# Altium schematic sheet T1_Power_Top_Level.SchDoc
size 431 x 279 mm; Date: Not shown in title block; ApprovedBy: Not shown in title block; CheckedBy: Not shown in title block; Author: Not shown in title block; CompanyName: Not shown in title block; DrawnBy: Andy Lin (TI); Engineer: Not shown in title block; Organization: Not shown in title block; Address1: Not shown in title block; Address2: Not shown in title block; Address3: Not shown in title block; Address4: Not shown in title block; DocumentNumber: 3; Revision: Use project parameter SCH_Rev; SheetNumber: 3; SheetTotal: 14; PageSetup: Record=PageOptions|CenterHorizontal=True|CenterVertical=True|PrintScale=1.00|XCorrection=1.00|YCorrection=1.00|PrintKind=0|BorderSize=5000000|LeftOffset=0|BottomOffset=0|Orientation=2|PaperLength=1000|PaperWidth=1000|Scale=100|PaperSource=15|PrintQuality=600|MediaType=1|DitherType=10|PaperKind=Letter|PrintScaleMode=1; CurrentTime: Not shown in title block; CurrentDate: Not shown in title block; Time: Not shown in title block; DocumentFullPathAndName: Not shown in title block; DocumentName: Not shown in title block; ModifiedDate: Not shown in title block; ImagePath: Not shown in title block
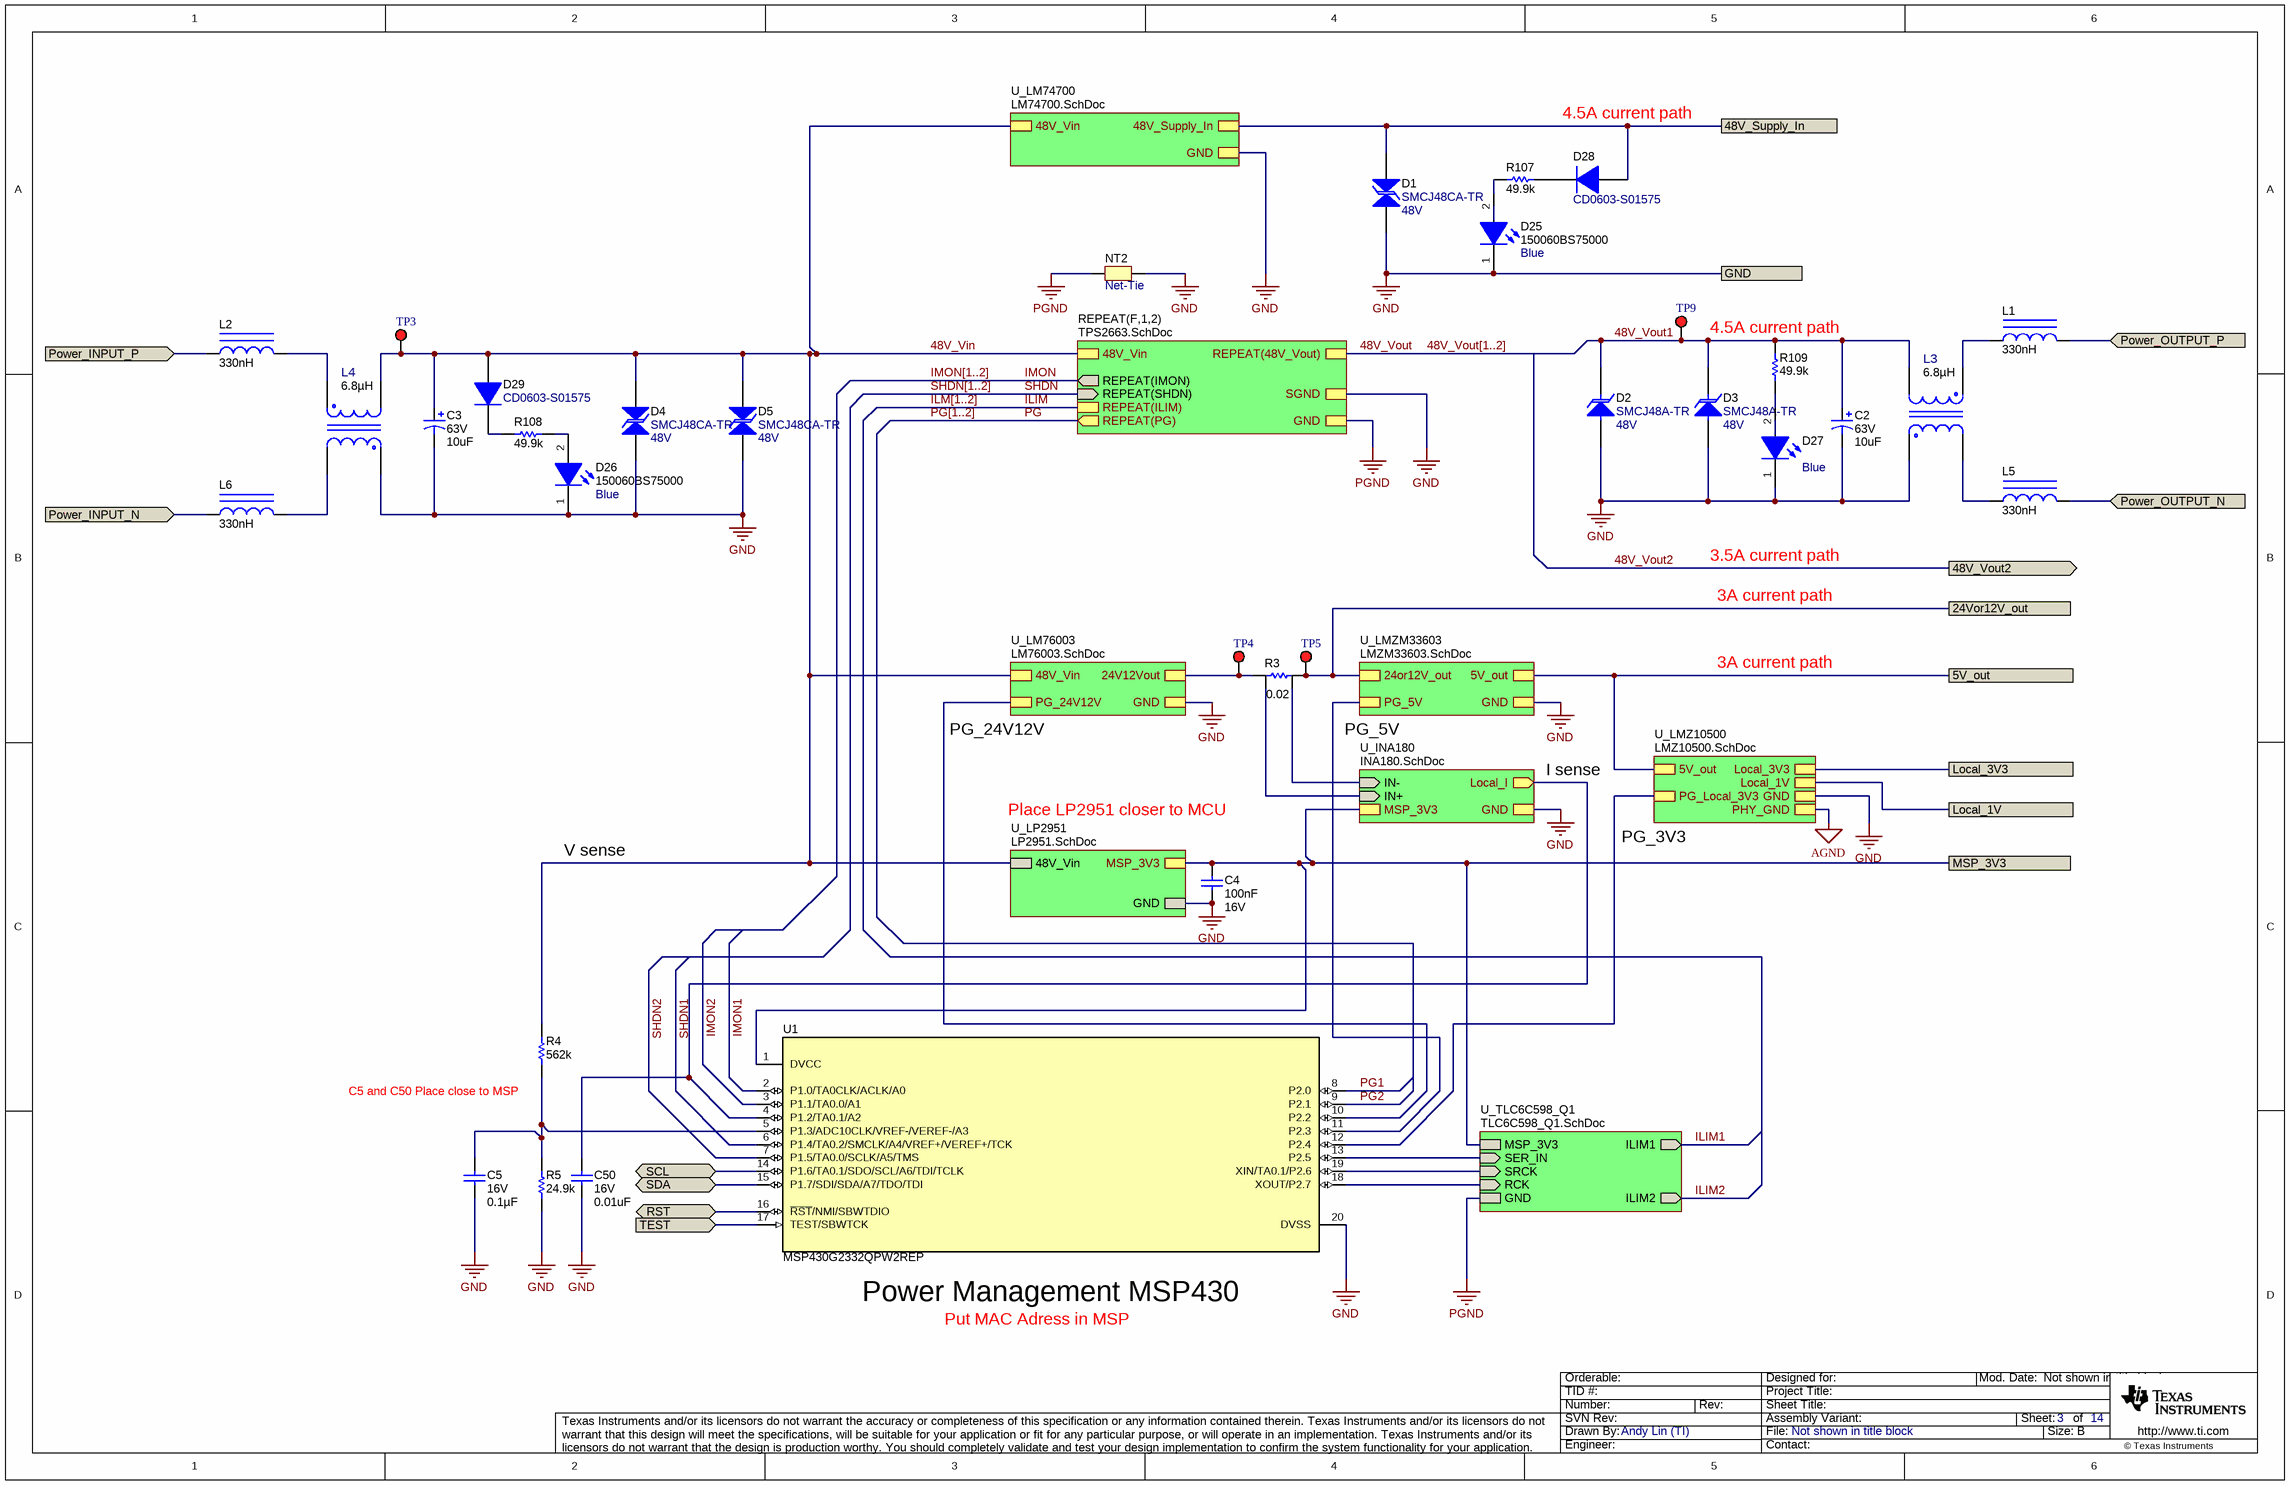
[diagram p0: T1_Power_Top_Level.SchDoc]

## Parts
C2  VDC_V: 63V  ValueDisplayed: 10uF  [3216-18]  (hidden comment: 293D106X9063E2TE3)
C3  VDC_V: 63V  ValueDisplayed: 10uF  [3216-18]  (hidden comment: 293D106X9063E2TE3)
C4  Cap_F: 100nF  VDC_V: 16V  [0603]  (hidden comment: GRM188R71C104KA01D)
C5  VDC_V: 16V  ValueDisplayed: 0.1µF  [0402]  (hidden comment: GCM155R71C104JA55D)
C50  VDC_V: 16V  ValueDisplayed: 0.01uF  [0402]  (hidden comment: GRM155R71C103KA01D)
D1  SMCJ48CA-TR  value 48V  [SMC_Bi]
D2  SMCJ48A-TR  value 48V  [SMC]
D3  SMCJ48A-TR  value 48V  [SMC]
D4  SMCJ48CA-TR  value 48V  [SMC_Bi]
D5  SMCJ48CA-TR  value 48V  [SMC_Bi]
D25  150060BS75000  value Blue  [WL-SMCW_Blue]
D26  150060BS75000  value Blue  [WL-SMCW_Blue]
D27  value Blue  [WL-SMCW_Blue]  (hidden comment: 150060BS75000)
D28  CD0603-S01575  [Diode_0603]
D29  CD0603-S01575  [Diode_0603]
L1  ValueDisplayed: 330nH  [WE-MAPI_3020]  (hidden comment: 744383360033)
L2  ValueDisplayed: 330nH  [WE-MAPI_3020]  (hidden comment: 744383360033)
L3  Ind_H: 6.8µH  [FP-7448991068_SMT_10MM0_10MM0-MFG]  (hidden comment: 7448991068)
L4  Ind_H: 6.8µH  [FP-7448991068_SMT_10MM0_10MM0-MFG]  (hidden comment: 7448991068)
L5  ValueDisplayed: 330nH  [WE-MAPI_3020]  (hidden comment: 744383360033)
L6  ValueDisplayed: 330nH  [WE-MAPI_3020]  (hidden comment: 744383360033)
NT2  Net-Tie  [NetTie_0402]  (net tie, no BOM)
R3  ValueDisplayed: 0.02  [LVK12]  (hidden comment: LVK12R020FER)
R4  ValueDisplayed: 562k  [0402]  (hidden comment: CRCW0402562KFKED)
R5  ValueDisplayed: 24.9k  [0402]  (hidden comment: CRCW040224K9FKED)
R107  ValueDisplayed: 49.9k  [0603]  (hidden comment: CRCW060349K9FKEA)
R108  ValueDisplayed: 49.9k  [0603]  (hidden comment: CRCW060349K9FKEA)
R109  ValueDisplayed: 49.9k  [0603]  (hidden comment: CRCW060349K9FKEA)
TP3  5000  [Keystone5000]  (value not drawn)
TP4  5000  [Keystone5000]  (value not drawn)
TP5  5000  [Keystone5000]  (value not drawn)
TP9  5000  [Keystone5000]  (value not drawn)
U1  MSP430G2332QPW2REP  [PW0020A_L]

## Sub-sheets
REPEAT(F,1,2) = TPS2663.SchDoc: REPEAT(SHDN) (in), REPEAT(IMON) (out), 48V_Vin, REPEAT(48V_Vout), REPEAT(ILIM), GND, REPEAT(PG) (out), SGND
U_INA180 = INA180.SchDoc: IN+ (in), IN- (in), Local_I (out), GND, MSP_3V3
U_LM74700 = LM74700.SchDoc: GND, 48V_Vin, 48V_Supply_In
U_LM76003 = LM76003.SchDoc: 48V_Vin, GND, 24V12Vout, PG_24V12V
U_LMZ10500 = LMZ10500.SchDoc: 5V_out, GND, Local_3V3, Local_1V, PG_Local_3V3, PHY_GND
U_LMZM33603 = LMZM33603.SchDoc: 5V_out, 24or12V_out, GND, PG_5V
U_LP2951 = LP2951.SchDoc: 48V_Vin, GND, MSP_3V3
U_TLC6C598_Q1 = TLC6C598_Q1.SchDoc: ILIM2 (out), MSP_3V3, SER_IN (in), SRCK (in), RCK (in), GND, ILIM1 (out)

## Ports
5V_out, 24Vor12V_out, 48V_Supply_In, 48V_Vout2 (out), GND, Local_1V, Local_3V3, MSP_3V3, Power_INPUT_N (in), Power_INPUT_P (in), Power_OUTPUT_N (in), Power_OUTPUT_P (in), RST (bidir), SCL (bidir), SDA (bidir), TEST (in)

## Nets
AGND: sheet U_LMZ10500/PHY_GND
GND: C2.2(-) C3.2(-) C4.2 C5.2 C50.2 D1.1 D2.2(A) D3.2(A) D4.1 D5.1 D25.1(K) D26.1(K) D27.1(K) L3.1 L4.3 NT2.2 R5.1 U1.20(DVSS) ; port GND, sheet U_LM76003/GND, sheet U_LMZM33603/GND, sheet U_LMZ10500/GND, sheet U_INA180/GND, sheet U_LM74700/GND, sheet REPEAT(F,1,2)/SGND, sheet U_LP2951/GND
PGND: NT2.1 ; sheet REPEAT(F,1,2)/GND, sheet U_TLC6C598_Q1/GND
5V_out: port 5V_out, sheet U_LMZM33603/5V_out, sheet U_LMZ10500/5V_out
24Vor12V_out: R3.1 TP5.1 ; port 24Vor12V_out, sheet U_LMZM33603/24or12V_out
48V_Supply_In: D1.2 D28.2(A) ; port 48V_Supply_In, sheet U_LM74700/48V_Supply_In
48V_Vin: C3.1(+) D4.2 D5.2 D29.2(A) L4.2 R4.2 TP3.1 ; sheet U_LM76003/48V_Vin, sheet U_LM74700/48V_Vin, sheet REPEAT(F,1,2)/48V_Vin, sheet U_LP2951/48V_Vin
48V_Vout: sheet REPEAT(F,1,2)/REPEAT(48V_Vout)
48V_Vout1: C2.1(+) D2.1(K) D3.1(K) L3.4 R109.2 TP9.1
48V_Vout2: port 48V_Vout2
ILIM: sheet REPEAT(F,1,2)/REPEAT(ILIM)
ILIM1: sheet U_TLC6C598_Q1/ILIM1
ILIM2: sheet U_TLC6C598_Q1/ILIM2
IMON: sheet REPEAT(F,1,2)/REPEAT(IMON)
IMON1: U1.2(P1.0/TA0CLK/ACLK/A0)
IMON2: U1.3(P1.1/TA0.0/A1)
Local_1V: port Local_1V, sheet U_LMZ10500/Local_1V
Local_3V3: port Local_3V3, sheet U_LMZ10500/Local_3V3
MSP_3V3: C4.1 U1.1(DVCC) ; port MSP_3V3, sheet U_INA180/MSP_3V3, sheet U_LP2951/MSP_3V3, sheet U_TLC6C598_Q1/MSP_3V3
PG: sheet REPEAT(F,1,2)/REPEAT(PG)
PG1: U1.8(P2.0)
PG2: U1.9(P2.1)
Power_INPUT_N: L6.1 ; port Power_INPUT_N
Power_INPUT_P: L2.1 ; port Power_INPUT_P
Power_OUTPUT_N: L5.2 ; port Power_OUTPUT_N
Power_OUTPUT_P: L1.2 ; port Power_OUTPUT_P
RST: U1.16(~{RST}/NMI/SBWTDIO) ; port RST
SCL: U1.14(P1.6/TA0.1/SDO/SCL/A6/TDI/TCLK) ; port SCL
SDA: U1.15(P1.7/SDI/SDA/A7/TDO/TDI) ; port SDA
SHDN: sheet REPEAT(F,1,2)/REPEAT(SHDN)
SHDN1: U1.6(P1.4/TA0.2/SMCLK/A4/VREF+/VEREF+/TCK)
SHDN2: U1.7(P1.5/TA0.0/SCLK/A5/TMS)
TEST: U1.17(TEST/SBWTCK) ; port TEST
NetC5_1: C5.1 R4.1 R5.2 U1.5(P1.3/ADC10CLK/VREF-/VEREF-/A3)
NetC50_1: C50.1 U1.4(P1.2/TA0.1/A2) ; sheet U_INA180/Local_I
NetD25_2: D25.2(A) R107.2
NetD26_2: D26.2(A) R108.1
NetD27_2: D27.2(A) R109.1
NetD28_1: D28.1(K) R107.1
NetD29_1: D29.1(K) R108.2
NetL1_1: L1.1 L3.3
NetL2_2: L2.2 L4.1
NetL3_2: L3.2 L5.1
NetL4_4: L4.4 L6.2
NetR3_2: R3.2 TP4.1 ; sheet U_LM76003/24V12Vout
NetR3_3: R3.3 ; sheet U_INA180/IN-
NetR3_4: R3.4 ; sheet U_INA180/IN+
NetU1_10: U1.10(P2.2) ; sheet U_LM76003/PG_24V12V
NetU1_11: U1.11(P2.3) ; sheet U_LMZM33603/PG_5V
NetU1_12: U1.12(P2.4) ; sheet U_LMZ10500/PG_Local_3V3
NetU1_13: U1.13(P2.5) ; sheet U_TLC6C598_Q1/SER_IN
NetU1_18: U1.18(XOUT/P2.7) ; sheet U_TLC6C598_Q1/RCK
NetU1_19: U1.19(XIN/TA0.1/P2.6) ; sheet U_TLC6C598_Q1/SRCK

## Buses and harness runs
bus 48V_Vout[1..2]
bus ILM[1..2]
bus IMON[1..2]
bus PG[1..2]
bus SHDN[1..2]

## Notes on the sheet
- 4.5A current path
- 3.5A current path
- 3A current path
- PG_24V12V
- PG_5V
- I sense
- Place LP2951 closer to MCU
- PG_3V3
- V sense
- (near R4) C5 and C50 Place close to MSP
- (near U1) Power Management MSP430
- Put MAC Adress in MSP
- Drawn By:
- SVN Rev:
- Number:
- TID #:
- Orderable:
- Rev:
- Sheet Title:
- File:
- Project Title:
- Designed for:
- Assembly Variant:
- Mod. Date:
- Sheet:
- Size:
- of
- B
- http://www.ti.com
- Texas Instruments and/or its licensors do not warrant the accuracy or completeness of this specification or any information contained therein. Texas Instruments and/or its licensors do not warrant that this design will meet the specifications, will be suitable for your application or fit for any particular purpose, or will operate in an implementation. Texas Instruments and/or its licensors do not warrant that the design is production worthy. You should completely validate and test your design implementation to confirm the system functionality for your application.
- Engineer:
- Contact:
- © Texas Instruments

## Library data of the parts
C2 C3 = CMP-0011450-1: CAP, TA, 10 uF, 63 V, +/- 10%, 1 ohm, SMD; Manufacturer: Vishay-Sprague; TaMin_C: -55°C; ESR_ohm: 1; Polarized: Y; SizeAreaWB_mm2: 10.92; Value1: 1 ohm; U/M: EA; Value: 10uF; TaMax_C: 125°C; SizeZ_mm: 1.8; SizeX_mm: 3.2; SizeY_mm: 1.6; SizeArea_mm2: 5.12; CompType: Capacitor; Cap_F: 10µF; IRMS_A: 580mA; AEC Category: Q200; ComponentLink1URL: http://www.vishay.com/docs/40002/293d.pdf; Publisher: Texas Instruments; RoHS: Y; MountType: SMT; Supplier 1: Digi-Key; LatestRevisionNote: Updated supplier links; PackageReference: 3216-18; Tolerance_%: 10%; Value2: 63V; LatestRevisionDate: 2017-03-09; PartNumber: 293D106X9063E2TE3; AEC Qualified: ?; Series: 293D; ComponentLink1Description: Datasheet link; Supplier Part Number 1: 718-1712-1-ND; Technology: TA
C4 = CMP-0007378-4: CAP, CERM, 0.1 uF, 16 V, +/- 10%, X7R, 0603; Manufacturer: MuRata; TaMin_C: -55°C; Polarized: N; SizeAreaWB_mm2: 4.68; Value1: Unknown; U/M: EA; Value: 0.1uF; TaMax_C: 125°C; SizeZ_mm: 1; SizeX_mm: 1.6; SizeY_mm: 0.8; SizeArea_mm2: 1.28; AEC Category: Q200; Supplier Part Number 2: 81-GRM39X104K16; Publisher: Texas Instruments; Supplier 2: Mouser; Supplier Part Number 3: 1828890; TempCo: X7R; Supplier 3: Farnell; Published: 2008-06-19; RoHS: Y; MountType: SMT; Supplier 1: Digi-Key; PackageReference: 0603; Tolerance_%: 10%; Cap_Case: 0603; Value2: 16V; CompType: Capacitor; LatestRevisionDate: 2017-03-09; PartNumber: GRM188R71C104KA01D; AEC Qualified: ?; ComponentLink1Description: Datasheet link; Supplier Part Number 1: 490-1532-1-ND; Technology: Ceramic; ValueDisplayed: 0.1uF; ComponentLink1URL: http://search.murata.co.jp/Ceramy/PnsearchViewAction.do?HnOFG=ON&HnNFG=ON&SEL_CNT=50&sLang=en&sKey=GRM188R71C104KA01D&x=9&y=9&search=startwith
C5 = CMP-0080702-1: CAP, CERM, 0.1 µF, 16 V,+/- 5%, X7R, AEC-Q200 Grade 1, 0402; Manufacturer: MuRata; Cap_F: 100nF; SizeAreaWB_mm2: 3; SizeArea_mm2: 0.5; AEC Qualified: Y; AEC Category: Q200; Value: 0.1uF; TaMax_C: 125°C; SizeZ_mm: 0.6; AEC Grade: 1; Polarized: N; TaMin_C: -55°C; U/M: EA; ComponentLink1Description: Datasheet link; RoHS: Y; Tolerance_%: 5%; Supplier 1: Digi-Key; PackageReference: 0402; Technology: Ceramic; PartNumber: GCM155R71C104JA55D; TempCo: X7R; Supplier Part Number 2: 81-GCM155R71C104JA5D; Supplier 2: Mouser; SizeY_mm: 0.5; Value2: 16V; ComponentLink1URL: https://search.murata.co.jp/Ceramy/image/img/A01X/G101/ENG/GCM155R71C104JA55-01.pdf; CompType: Capacitor; MountType: SMT; Supplier Part Number 1: 490-16433-1-ND; SizeX_mm: 1; Cap_Case: 0402
C50 = CMP-0006639-2: CAP, CERM, 0.01 uF, 16 V, +/- 10%, X7R, 0402; Manufacturer: MuRata; TaMin_C: -55°C; Polarized: N; SizeAreaWB_mm2: 3; Value1: Unknown; U/M: EA; Value: 0.01uF; TaMax_C: 125°C; SizeZ_mm: 0.6; SizeX_mm: 1; SizeY_mm: 0.5; Cap_F: 10nF; AEC Category: Q200; Supplier Part Number 2: 14T3279; Publisher: Texas Instruments; Supplier 2: Newark; Supplier Part Number 3: 81-GRM36X103K16; TempCo: X7R; Supplier 3: Mouser; Published: 2008-06-19; RoHS: Y; MountType: SMT; Supplier 1: Digi-Key; PackageReference: 0402; Tolerance_%: 10%; Cap_Case: 0402; Value2: 16V; SizeArea_mm2: 0.5; CompType: Capacitor; LatestRevisionDate: 2017-03-09; PartNumber: GRM155R71C103KA01D; AEC Qualified: ?; ComponentLink1Description: Datasheet link; Supplier Part Number 1: 490-1313-1-ND; Technology: Ceramic; ComponentLink1URL: http://search.murata.co.jp/Ceramy/PnsearchViewAction.do?HnOFG=ON&HnNFG=ON&SEL_CNT=50&sLang=en&sKey=GRM155R71C103KA01D&x=9&y=9&search=startwith
D1 D4 D5 = CMP-0085460-1: Diode, TVS, Bi, 48 V, 77.4 Vc, 1500 W, 20 A, SMC (No Polarity Mark); Manufacturer: STMicroelectronics; AEC Category: Q101; Ipp: 20A; Vc: 77.4V; RJA_CperW: 90; SizeX_mm: 7.94; SizeY_mm: 5.9; SizeArea_mm2: 46.846; SizeAreaWB_mm2: 78.526; Ppk: 1.5kW; AEC Qualified: N; Vbr_Min: 53.3V; SizeZ_mm: 2.62; MountType: SMT; PartNumber: SMCJ48CA-TR; Value1: 77.4V; ComponentLink1URL: https://www.st.com/resource/en/datasheet/smcj.pdf; ComponentLink1Description: Datasheet link; CompType: TVS; VRWM: 48V; RoHS: Y; PackageReference: SMC (No Polarity Mark)
D2 D3 = CMP-0085434-1: Diode, TVS, Uni, 48 V, 77.4 Vc, 1500 W, 20 A, SMC; Manufacturer: STMicroelectronics; SizeX_mm: 8.13; SizeY_mm: 6.22; SizeArea_mm2: 50.5686; Ipp: 20A; SizeZ_mm: 2.62; Value1: 77.4V; AEC Qualified: N; AEC Category: Q101; RJA_CperW: 90; Ppk: 1.5kW; Vbr_Min: 53.3V; SizeAreaWB_mm2: 83.2686; RoHS: Y; ComponentLink1URL: https://www.st.com/resource/en/datasheet/smcj.pdf; PartNumber: SMCJ48A-TR; VRWM: 48V; CompType: TVS; MountType: SMT; ComponentLink1Description: Datasheet link; Vc: 77.4V; PackageReference: SMC
D25-D27 = CMP-0002946-3: LED, Blue, SMD; Manufacturer: Wurth Elektronik; Power_TotalModule: 105mW; Angle: 140; Tjmax_C: 85°C; Vf_V: 3.2V; Io_A: 30mA; Value1: 0.105W; Vr_V: 5V; Type: InGaN; CompType: LED; Color: Blue; RoHS: Y; PackageReference: LED_0603; MountType: SMT; PartNumber: 150060BS75000; ComponentLink1URL: http://katalog.we-online.de/led/datasheet/150060BS75000.pdf; Value2: 3.2V; ComponentLink1Description: Datasheet link
D28 D29 = CMP-0029008-2: Diode, Switching, 100 V, 0.15 A, 0603 Diode; Manufacturer: Bourns; Vf_V: 1V; SizeAreaWB_mm2: 5.13; SizeX_mm: 1.7; Value1: 0.15A; Green_Lifecycle: Not Set; Io_A: 150mA; SizeArea_mm2: 1.53; SizeY_mm: 0.9; AEC Category: Q101; Vr_V: 100V; TJmax_C: 125°C; SizeZ_mm: 0.75; Green_REACh: Incomplete; Value: 100V; Green_EU RoHS: Incomplete; AEC Qualified: ?; Green_EU RoHS-2: Incomplete; MountType: SMT; CompType: Diode; ComponentLink1URL: http://www.bourns.com/pdfs/CD0603_1005.pdf; RoHS: Y; PartNumber: CD0603-S01575; PackageReference: 0603 Diode; Type: Switching; Value2: 1V; ComponentLink1Description: Datasheet link
L1 L2 L5 L6 = CMP-0064155-1: Inductor, 330 nH, 5.5 A, 0.014 ohm, SMD; Manufacturer: Wurth Elektronik; Isat: 8.3A @ 20% inductance drop; Irms: 5.5A @ 40C rise; Green_Lifecycle: Active; SizeAreaWB_mm2: 16; DCR_ohm: 0.014; Green_REACh: Passed; Value: 330nH; Imax_A: 5.5A; SizeZ_mm: 2; SizeX_mm: 3; SizeArea_mm2: 9; AEC Category: Q200; ComponentLink1URL: http://katalog.we-online.de/pbs/datasheet/744383360033.pdf; Supplier Part Number 2: 710-744383360033; Publisher: Texas Instruments; Supplier 2: Mouser; Published: 2008-06-26; RoHS: Y; Value1: 0.014 ohm; Material: ?; MountType: SMT; Green_EU RoHS-2: Incomplete; Supplier 1: Digi-Key; Green_EU RoHS: Passed; PackageReference: SMD, 2-Leads, Body 3.2x3.2mm; SizeY_mm: 3; Value2: 5.5A; CompType: Inductor; Ind_H: 330nH; LatestRevisionDate: 2017-06-02; PartNumber: 744383360033; AEC Qualified: ?; ComponentLink1Description: Datasheet link; Supplier Part Number 1: 732-5690-1-ND
L3 L4 = CMP-0086566-1: Shielded 2 Coil Inductor Array  Inductance - Connected in Series 6.8µH Inductance - Connected in Parallel 44mOhm DC Resistance (DCR) - Parallel 5A Nonstandard; Manufacturer: Wurth Electronics; SizeZ_mm: 4.1mm; DCR_ohm: 0.044; AEC Qualified: No; Symbol Name: SYM-7448991068; PackageReference: SMT_10MM0_10MM0; ComponentLink1Description: Datasheet; RoHS: TRUE; ComponentLink1URL: https://katalog.we-online.de/pbs/datasheet/7448991068.pdf; PartNumber: 7448991068
NT2 = CMP-0078142-2: Single point connection between nets.; CompType: Net-Tie; PackageReference: N/A; Library Reference: Net-Tie; Manufacturer: N/A; PartNumber: N/A; MountType: SMT
R3 = CMP-0015142-2: RES, 0.02, 1%, 0.5 W, 1206 sense; Manufacturer: Ohmite; Power_W: 500mW; TempCo: 50 ppm/C; Value_Code: R020; U/M: EA; Value: 0.02; EIA_Code: E96; Value2: 0.5W; CompType: Resistor; AEC Category: Q200; Supplier Part Number 2: 588-LVK12R020FER; Publisher: Texas Instruments; Supplier 2: Mouser; Supplier Part Number 3: 1462286; Supplier 3: Farnell; Published: 2008-06-26; RoHS: Y; Value1: 1%; MountType: SMT; Supplier 1: Digi-Key; PackageReference: 1206 sense; Tolerance_%: 1%; Res_ohm: 0.02; LatestRevisionDate: 2017-03-09; PartNumber: LVK12R020FER; AEC Qualified: ?; ComponentLink1Description: Datasheet link; Supplier Part Number 1: LVK12R020FERCT-ND; Technology: Thick Film; ComponentLink1URL: http://www.ohmite.com/catalog/pdf/lvk.pdf
R4 = CMP-0026451-2: RES, 562 k, 1%, 0.063 W, AEC-Q200 Grade 0, 0402; Manufacturer: Vishay-Dale; Power_W: 63mW; TempCo: 100 ppm/C; Value: 562k; EIA_Code: E96; SizeX_mm: 1; SizeY_mm: 0.5; SizeZ_mm: 0.6; Value2: 0.063W; AEC Qualified: Y; VDC_V: 50V; AEC Category: Q200; AEC Grade: 0; ComponentLink1URL: http://www.vishay.com/docs/20035/dcrcwe3.pdf; Supplier Part Number 2: 52K7162; Supplier 2: Newark; Supplier Part Number 3: 71-CRCW0402-562K-E3; Supplier 3: Mouser; Value_Code: 562k; RoHS: E; Value1: 1%; MountType: SMT; Supplier 1: Digi-Key; PackageReference: 0402; Tolerance_%: 1%; Res_ohm: 562k; SizeArea_mm2: 0.5; CompType: Resistor; PartNumber: CRCW0402562KFKED; ComponentLink1Description: Datasheet link; Supplier Part Number 1: 541-562KLCT-ND; Technology: Thick Film
R5 = CMP-0026196-2: RES, 24.9 k, 1%, 0.063 W, AEC-Q200 Grade 0, 0402; Manufacturer: Vishay-Dale; Power_W: 63mW; TempCo: 100 ppm/C; Value_Code: 24k9; Value: 24.9k; EIA_Code: E96; SizeX_mm: 1; SizeY_mm: 0.5; SizeZ_mm: 0.6; Value2: 0.063W; AEC Qualified: Y; VDC_V: 50V; AEC Category: Q200; AEC Grade: 0; ComponentLink1URL: http://www.vishay.com/docs/20035/dcrcwe3.pdf; Supplier Part Number 2: 52K6876; Supplier 2: Newark; Supplier Part Number 3: 71-CRCW0402-24.9K-E3; Supplier 3: Mouser; RoHS: E; Value1: 1%; MountType: SMT; Supplier 1: Digi-Key; PackageReference: 0402; Tolerance_%: 1%; Res_ohm: 24.9k; SizeArea_mm2: 0.5; CompType: Resistor; PartNumber: CRCW040224K9FKED; ComponentLink1Description: Datasheet link; Supplier Part Number 1: 541-24.9KLCT-ND; Technology: Thick Film
R107-R109 = CMP-0022447-1: RES, 49.9 k, 1%, 0.1 W, 0603; Manufacturer: Vishay-Dale; Power_W: 100mW; TempCo: 100 ppm/C; Value_Code: 49k9; U/M: EA; Value: 49.9k; EIA_Code: E96; SizeX_mm: 1.6; SizeY_mm: 0.8; SizeZ_mm: 1; Value2: 0.1W; SizeArea_mm2: 1.28; VDC_V: 75V; AEC Category: Q200; ComponentLink1URL: http://www.vishay.com/docs/20035/dcrcwe3.pdf; Supplier Part Number 2: 71-CRCW0603-49.9K-E3; Publisher: Texas Instruments; Supplier 2: Mouser; Supplier Part Number 3: 1652882; Supplier 3: Farnell; Published: 2008-06-26; RoHS: Y; Value1: 1%; MountType: SMT; Supplier 1: Digi-Key; PackageReference: 0603; Tolerance_%: 1%; Res_ohm: 49.9k; CompType: Resistor; LatestRevisionDate: 2017-03-09; PartNumber: CRCW060349K9FKEA; AEC Qualified: ?; ComponentLink1Description: Datasheet link; Supplier Part Number 1: 541-49.9KHCT-ND; Technology: Thick Film
TP3-TP5 TP9 = CMP-0055137-1: Test Point, Miniature, Red, TH; Manufacturer: Keystone; CNHeader: FALSE; Green_Lifecycle: Active; Green_REACh: Passed; ContactFinish: Silver; CT: TRUE; ComponentLink1URL: http://www.keyelco.com/userAssets/file/M60-2p60.pdf; Supplier Part Number 2: 534-5000; Publisher: Texas Instruments; Supplier 2: Mouser; Color: Red; RoHS: Y; MountType: TH; Green_EU RoHS-2: Incomplete; Supplier 1: Digi-Key; Green_EU RoHS: Passed; PackageReference: Red Miniature Testpoint; CompType: Test Point; LatestRevisionDate: 26/05/2017; PartNumber: 5000; ComponentLink1Description: Datasheet URL; Supplier Part Number 1: 36-5000-ND
U1 = CMP-0076660-1: Enhanced Product Mixed Signal Microcontroller, PW0020A (TSSOP-20); Manufacturer: Texas Instruments; Alternate PartNumber: MSP430G2332QPW2EP; SizeAreaWB_mm2: 73.96; SizeArea_mm2: 43.56; SizeZ_mm: 1.2; SizeY_mm: 6.6; U/M: EA; CompType: IC; ComponentLink1Description: Datasheet Link; RoHS: Y; PackageReference: PW0020A; PartNumber: MSP430G2332QPW2REP; Publisher: Texas Instruments; PackageDescription: TSSOP-20; Alternate Manufacturer: Texas Instruments; ComponentLink1URL: http://www.ti.com/lit/ds/symlink/msp430g2332-ep.pdf; LatestRevisionDate: 2017-06-09; MountType: SMT; SizeX_mm: 6.6